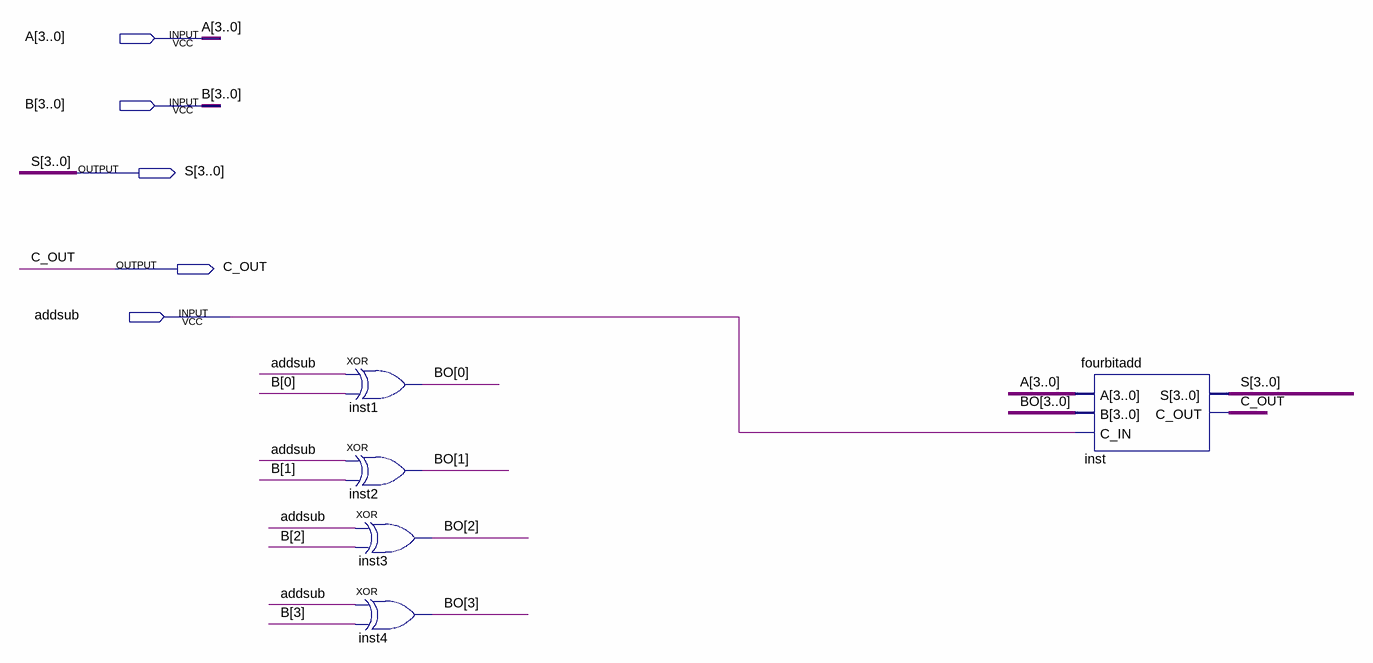
[diagram p0: schematic sheet]
// Quartus schematic addsub.bdf as structural Verilog: 5 symbols, 5 pins
module addsub (
  input  [3:0] A,
  input  [3:0] B,
  input  addsub,
  output [3:0] S,
  output C_OUT
);

  wire [3:0] BO;

  xor inst1 (BO[0], addsub, B[0]);
  xor inst2 (BO[1], addsub, B[1]);
  xor inst3 (BO[2], addsub, B[2]);
  xor inst4 (BO[3], addsub, B[3]);
  fourbitadd inst (.A(A), .B(BO), .C_IN(addsub), .S(S), .C_OUT(C_OUT));
endmodule
